# Altium schematic sheet Sheet3.SchDoc
size B
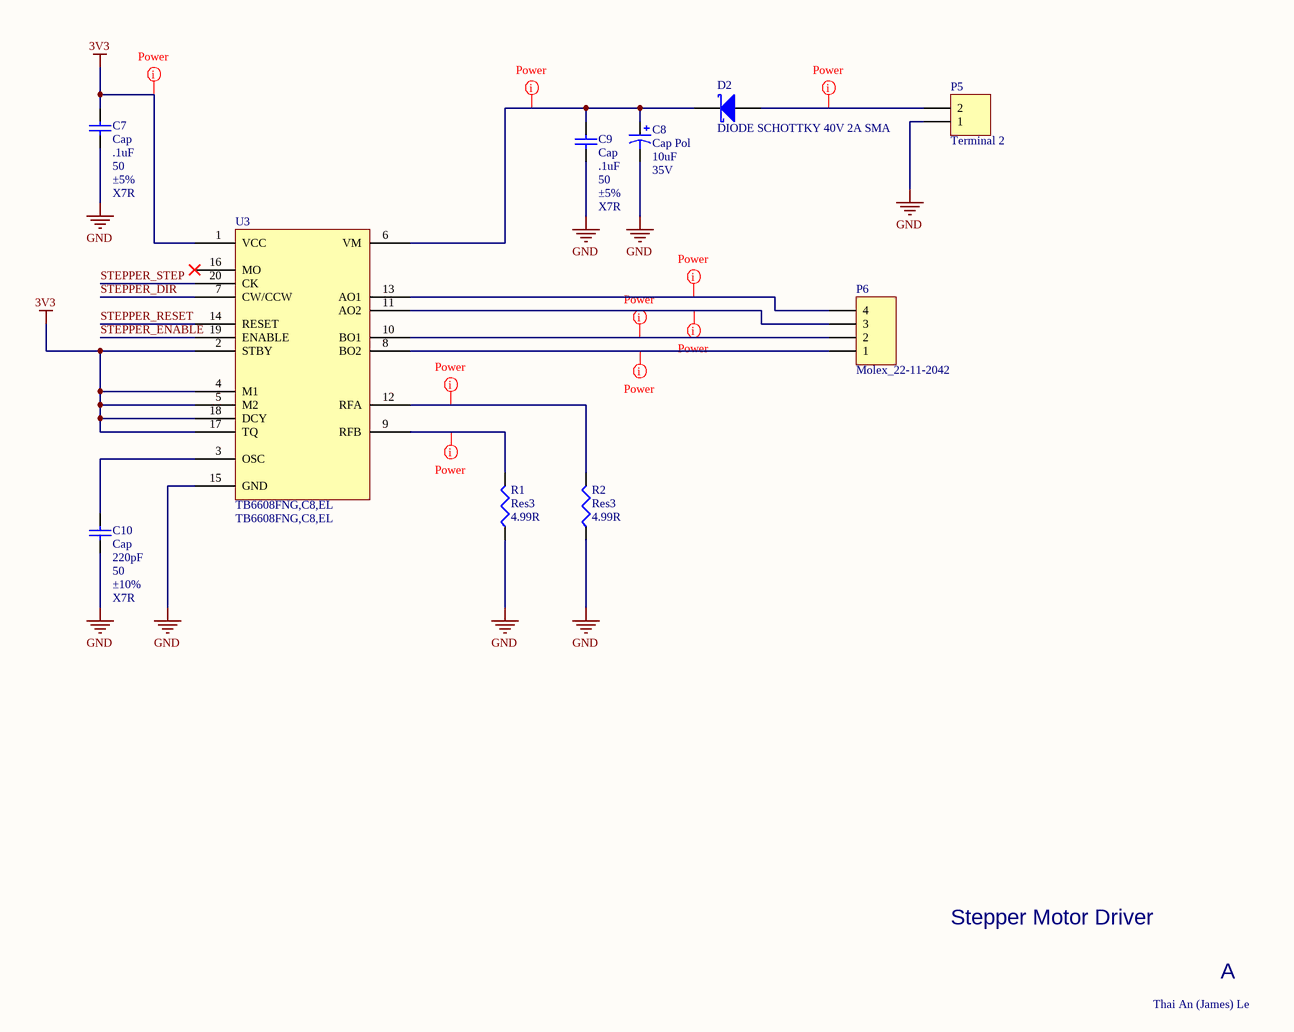
[diagram p0: Sheet3.SchDoc]

## Parts
C7  Cap  value .1uF  WV: 50  Tolerance: ±5%  Type: X7R  [CAPC2012X09M]
C8  Cap Pol  value 10uF  Voltage: 35V  [CAPACITOR_5MM]
C9  Cap  value .1uF  WV: 50  Tolerance: ±5%  Type: X7R  [CAPC2012X09M]
C10  Cap  value 220pF  WV: 50  Tolerance: ±10%  Type: X7R  [CAPC2012X09M]
D2  DIODE SCHOTTKY 40V 2A SMA  [DIOM4326X23M]
P5  Terminal 2  [TYCO_282841_2]
P6  Molex_22-11-2042  [MOLEX-22-11-2042]
R1  Res3  value 4.99R  [RESC2112X05M]
R2  Res3  value 4.99R  [RESC2112X05M]
U3  TB6608FNG,C8,EL  [TSOP65P640X160-20M]

## Nets
3V3: C7.2 U3.1(VCC) U3.2(STBY) U3.4(M1) U3.5(M2) U3.17(TQ) U3.18(DCY)
GND: C7.1 C8.2 C9.1 C10.1 P5.1 R1.1 R2.1 U3.15(GND)
STEPPER_DIR: U3.7(CW/CCW)
STEPPER_ENABLE: U3.19(ENABLE)
STEPPER_RESET: U3.14(RESET)
STEPPER_STEP: U3.20(CK)
NetC8_1: C8.1 C9.2 D2.1(K) U3.6(VM)
NetC10_2: C10.2 U3.3(OSC)
NetD2_2: D2.2(A) P5.2
NetP6_1: P6.1 U3.8(BO2)
NetP6_2: P6.2 U3.10(BO1)
NetP6_3: P6.3 U3.11(AO2)
NetP6_4: P6.4 U3.13(AO1)
NetR1_2: R1.2 U3.9(RFB)
NetR2_2: R2.2 U3.12(RFA)

Not connected (* = marked no-connect by the designer): U3 16(MO)*

## Layout directives
net class POWER: 3V3, NetC8_1, NetD2_2, NetP6_1, NetP6_2, NetP6_3, NetP6_4, NetR1_2, NetR2_2

## Notes on the sheet
- Stepper Motor Driver
- A
- Thai An (James) Le

## Library data of the parts
C7 C9 = CAP-X7R-.1uF-50V-±5%: CAP CER .1uF 50v X7R 0805; MPN: C0805C104J5RACTU; PN: 399-1171-1-ND; Name: CAP-X7R-.1uF-50V-±5%; URL: http://www.digikey.ca/product-detail/en/C0805C104J5RACTU/399-1171-1-ND
C8 = Cap Polar-10uF-35V: CAP 85C 10uF ±20% 35V WX Series Aluminum Electrolytic; MPN: UWX1V100MCL1GB; Tan Theta: 0.12; Leakage Current: 3.5; Rated Ripple Current: 29; PN: 493-2117-1-ND; Name: Cap Polar-10uF-35V; Diameter: 5; URL: http://www.digikey.ca/product-detail/en/UWX1V100MCL1GB/493-2117-1-ND
C10 = CAP-X7R-220pF-50V-±10%: CAP CER 220pF 50v X7R 0805; MPN: C0805C221K5RACTU; PN: 399-1138-1-ND; Name: CAP-X7R-220pF-50V-±10%; URL: http://www.digikey.ca/product-detail/en/C0805C221K5RACTU/399-1138-1-ND
D2 = DIODE SCHOTTKY 40V 2A SMA: Schottky Rectifier; MPN: B240A-13-F; PN: B240A-FDICT-ND; URL: http://www.digikey.ca/product-detail/en/B240A-13-F/B240A-FDICT-ND
P5 = Terminal 2: Terminal, 2-Pin; MPN: 282841-2; PN: A98342-ND; LatestRevisionDate: 17-Jul-2002; LatestRevisionNote: Re-released for DXP Platform.; Publisher: Altium Limited; URL: http://www.digikey.ca/product-detail/en/282841-2/A98342-ND/1136740
P6 = Molex_22-11-2042: CONN HEADER 4POS .100 VERT GOLD; MPN: 0022112042; PN: WM2702-ND; URL: http://www.digikey.ca/product-detail/en/0022112042/WM2702-ND
R1 R2 = Resistor_4.99R: RES SMD 4.99R OHM 1% 1/8W 0805; MPN: CRCW08054R99FKEA; PN: 541-4.99CCCT-ND; Name: Resistor_4.99R; URL: http://www.digikey.ca/product-detail/en/CRCW08054R99FKEA/541-4.99CCCT-ND
U3 = TB6608FNG,C8,EL: IC MTR DRV BIPLR 2.7-5.5V 20SSOP; PN: TB6608FNGC8ELCT-ND; URL: https://www.digikey.ca/en/products/detail/toshiba-semiconductor-and-storage/TB6608FNG-C8-EL/1730074; MPN: TB6608FNG,C8,EL